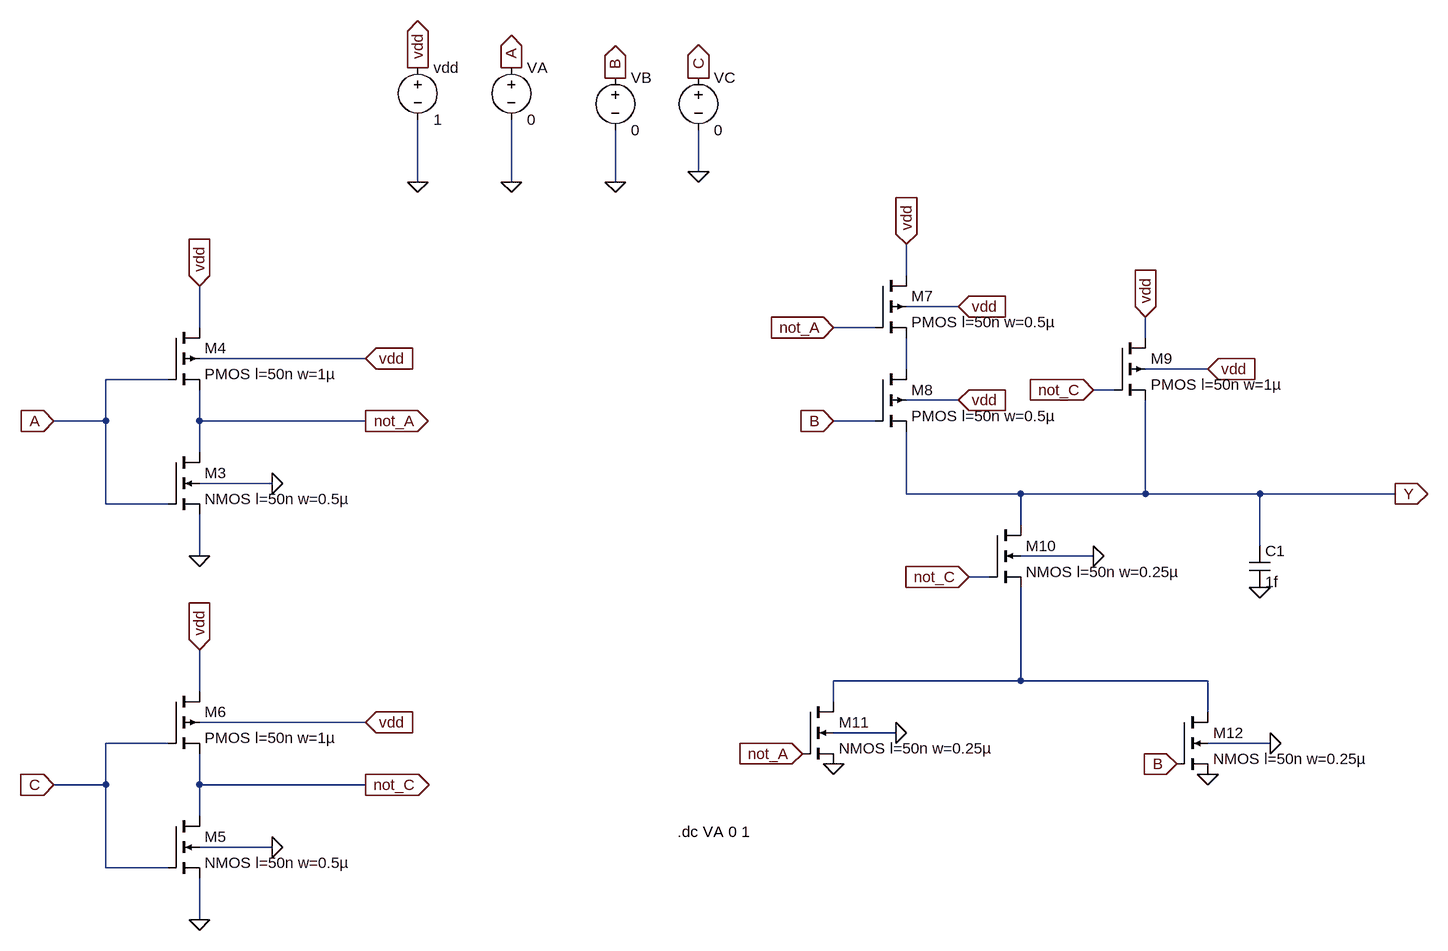
[diagram p0: schematic CircuitDC.asc]
CircuitDC.asc, the LTspice schematic file:
Version 4
SHEET 1 1996 940
WIRE 848 -832 848 -896
WIRE 416 -816 416 -912
WIRE 560 -816 560 -912
WIRE 720 -816 720 -896
WIRE 1168 -672 1168 -720
WIRE 1248 -624 1168 -624
WIRE 80 -592 80 -656
WIRE 1120 -592 1056 -592
WIRE 1536 -576 1536 -608
WIRE 336 -544 80 -544
WIRE 1168 -528 1168 -576
WIRE 1632 -528 1536 -528
WIRE 32 -512 -64 -512
WIRE 1488 -496 1456 -496
WIRE 1248 -480 1168 -480
WIRE -64 -448 -64 -512
WIRE -64 -448 -144 -448
WIRE 80 -448 80 -496
WIRE 336 -448 80 -448
WIRE 1120 -448 1056 -448
WIRE 80 -400 80 -448
WIRE 192 -352 80 -352
WIRE 1168 -336 1168 -432
WIRE 1344 -336 1168 -336
WIRE 1536 -336 1536 -480
WIRE 1536 -336 1344 -336
WIRE 1712 -336 1536 -336
WIRE 1920 -336 1712 -336
WIRE -64 -320 -64 -448
WIRE 32 -320 -64 -320
WIRE 1344 -288 1344 -336
WIRE 1712 -256 1712 -336
WIRE 80 -240 80 -304
WIRE 1456 -240 1344 -240
WIRE 1296 -208 1264 -208
WIRE 1344 -48 1344 -192
WIRE 1344 -48 1056 -48
WIRE 1632 -48 1344 -48
WIRE 80 -32 80 -96
WIRE 1056 -16 1056 -48
WIRE 1632 0 1632 -48
WIRE 336 16 80 16
WIRE 1152 32 1056 32
WIRE 32 48 -64 48
WIRE 1728 48 1632 48
WIRE -64 112 -64 48
WIRE -64 112 -144 112
WIRE 80 112 80 64
WIRE 336 112 80 112
WIRE 80 160 80 112
WIRE 192 208 80 208
WIRE -64 240 -64 112
WIRE 32 240 -64 240
WIRE 80 320 80 256
FLAG 336 -544 vdd
IOPIN 336 -544 In
FLAG -144 -448 A
IOPIN -144 -448 In
FLAG 80 -656 vdd
IOPIN 80 -656 In
FLAG 336 -448 not_A
IOPIN 336 -448 Out
FLAG 80 -240 0
FLAG 192 -352 0
FLAG 336 16 vdd
IOPIN 336 16 In
FLAG -144 112 C
IOPIN -144 112 In
FLAG 80 -96 vdd
IOPIN 80 -96 In
FLAG 336 112 not_C
IOPIN 336 112 Out
FLAG 80 320 0
FLAG 192 208 0
FLAG 1168 -720 vdd
IOPIN 1168 -720 In
FLAG 1536 -608 vdd
IOPIN 1536 -608 In
FLAG 1248 -624 vdd
IOPIN 1248 -624 In
FLAG 1632 -528 vdd
IOPIN 1632 -528 In
FLAG 1248 -480 vdd
IOPIN 1248 -480 In
FLAG 1056 -592 not_A
IOPIN 1056 -592 In
FLAG 1056 -448 B
IOPIN 1056 -448 In
FLAG 1456 -496 not_C
IOPIN 1456 -496 In
FLAG 1456 -240 0
FLAG 1728 48 0
FLAG 1632 96 0
FLAG 1056 80 0
FLAG 1152 32 0
FLAG 1264 -208 not_C
IOPIN 1264 -208 In
FLAG 1008 64 not_A
IOPIN 1008 64 In
FLAG 1584 80 B
IOPIN 1584 80 In
FLAG 1920 -336 Y
IOPIN 1920 -336 Out
FLAG 1712 -192 0
FLAG 416 -816 0
FLAG 560 -816 0
FLAG 720 -816 0
FLAG 848 -832 0
FLAG 416 -992 vdd
IOPIN 416 -992 Out
FLAG 560 -992 A
IOPIN 560 -992 Out
FLAG 720 -976 B
IOPIN 720 -976 Out
FLAG 848 -976 C
IOPIN 848 -976 Out
SYMBOL nmos4 32 -400 R0
SYMATTR InstName M3
SYMATTR Value NMOS l=50n w=0.5µ
SYMATTR Value2 l=50n w=0.5µ
SYMBOL pmos4 32 -592 R0
SYMATTR InstName M4
SYMATTR Value PMOS l=50n w=1µ
SYMATTR Value2 l=50n w=1µ
SYMBOL nmos4 32 160 R0
SYMATTR InstName M5
SYMATTR Value NMOS l=50n w=0.5µ
SYMATTR Value2 l=50n w=0.5µ
SYMBOL pmos4 32 -32 R0
SYMATTR InstName M6
SYMATTR Value PMOS l=50n w=1µ
SYMATTR Value2 l=50n w=1µ
SYMBOL pmos4 1120 -672 R0
SYMATTR InstName M7
SYMATTR Value PMOS l=50n w=0.5µ
SYMATTR Value2 l=50n w=0.5µ
SYMBOL pmos4 1120 -528 R0
SYMATTR InstName M8
SYMATTR Value PMOS l=50n w=0.5µ
SYMATTR Value2 l=50n w=0.5µ
SYMBOL pmos4 1488 -576 R0
SYMATTR InstName M9
SYMATTR Value PMOS l=50n w=1µ
SYMATTR Value2 l=50n w=1µ
SYMBOL nmos4 1296 -288 R0
SYMATTR InstName M10
SYMATTR Value NMOS l=50n w=0.25µ
SYMATTR Value2 l=50n w=0.25µ
SYMBOL nmos4 1008 -16 R0
SYMATTR InstName M11
SYMATTR Value NMOS l=50n w=0.25µ
SYMATTR Value2 l=50n w=0.25µ
SYMBOL nmos4 1584 0 R0
SYMATTR InstName M12
SYMATTR Value NMOS l=50n w=0.25µ
SYMBOL cap 1696 -256 R0
SYMATTR InstName C1
SYMATTR Value 1f
SYMBOL voltage 416 -1008 R0
SYMATTR InstName vdd
SYMATTR Value 1
SYMBOL voltage 560 -1008 R0
SYMATTR InstName VA
SYMATTR Value 0
SYMBOL voltage 720 -992 R0
SYMATTR InstName VB
SYMATTR Value 0
SYMBOL voltage 848 -992 R0
WINDOW 123 0 0 Left 0
WINDOW 39 0 0 Left 0
SYMATTR InstName VC
SYMATTR Value 0
TEXT 816 184 Left 2 !.dc VA 0 1

The netlist it stands for:
* CircuitDC.asc
M3 not_A A 0 0 NMOS l=50n w=0.5µ l=50n w=0.5µ
M4 vdd A not_A vdd PMOS l=50n w=1µ l=50n w=1µ
M5 not_C C 0 0 NMOS l=50n w=0.5µ l=50n w=0.5µ
M6 vdd C not_C vdd PMOS l=50n w=1µ l=50n w=1µ
M7 vdd not_A N001 vdd PMOS l=50n w=0.5µ l=50n w=0.5µ
M8 N001 B Y vdd PMOS l=50n w=0.5µ l=50n w=0.5µ
M9 vdd not_C Y vdd PMOS l=50n w=1µ l=50n w=1µ
M10 Y not_C N002 0 NMOS l=50n w=0.25µ l=50n w=0.25µ
M11 N002 not_A 0 0 NMOS l=50n w=0.25µ l=50n w=0.25µ
M12 N002 B 0 0 NMOS l=50n w=0.25µ
C1 Y 0 1f
vdd vdd 0 1
VA A 0 0
VB B 0 0
VC C 0 0
.model NMOS NMOS
.model PMOS PMOS
.lib standard.mos
.dc VA 0 1
.backanno
.end

* Results of the author's LTspice run, read from the files saved beside the schematic
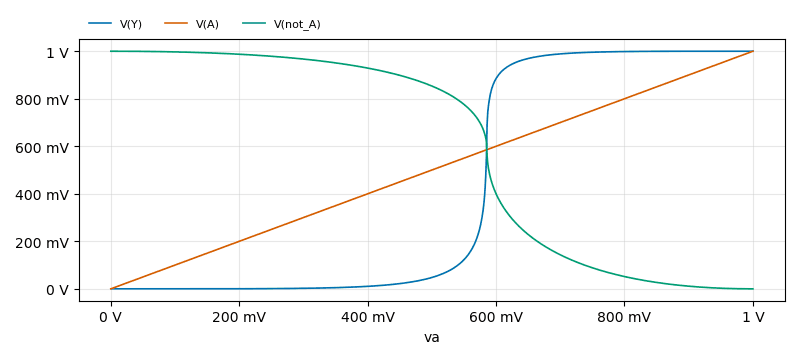
[diagram p1: DC transfer characteristic of CircuitDC.asc, plotted from the saved traces]
* DC transfer characteristic, 1 run:
*   V(Y): 120.8 nV at va=0 V, 1 V at va=1 V, min 120.8 nV, max 1 V
*   V(A): 0 V at va=0 V, 1 V at va=1 V, min 0 V, max 1 V
*   V(not_A): 1 V at va=0 V, 10.05 nV at va=1 V, min 10.05 nV, max 1 V